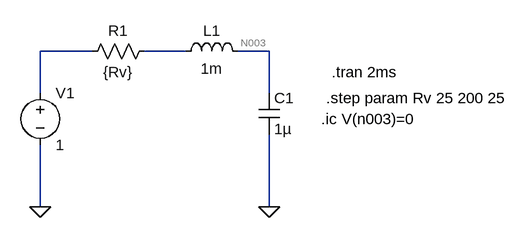
[diagram p0: schematic caso1_17_10.asc]
caso1_17_10.asc, the LTspice schematic file:
Version 4
SHEET 1 880 680
WIRE 112 64 32 64
WIRE 256 64 192 64
WIRE 384 64 336 64
WIRE 32 128 32 64
WIRE 384 128 384 64
WIRE 32 304 32 208
WIRE 384 304 384 192
FLAG 384 304 0
FLAG 32 304 0
SYMBOL voltage 32 112 R0
SYMATTR InstName V1
SYMATTR Value 1
SYMBOL res 208 48 R90
WINDOW 0 0 56 VBottom 2
WINDOW 3 32 56 VTop 2
SYMATTR InstName R1
SYMATTR Value {Rv}
SYMBOL ind 240 80 R270
WINDOW 0 32 56 VTop 2
WINDOW 3 5 56 VBottom 2
SYMATTR InstName L1
SYMATTR Value 1m
SYMBOL cap 368 128 R0
SYMATTR InstName C1
SYMATTR Value 1µ
TEXT 480 96 Left 2 !.tran 2ms
TEXT 472 136 Left 2 !.step param Rv 25 200 25
TEXT 464 168 Left 2 !.ic V(n003)=0

The netlist it stands for:
* caso1_17_10.asc
V1 N001 0 1
R1 N002 N001 {Rv}
L1 N002 N003 1m
C1 N003 0 1µ
.tran 2ms
.step param Rv 25 200 25
.ic V(n003)=0
.backanno
.end